# Altium schematic sheet MultimediaEthernet_USB.SchDoc
size Letter
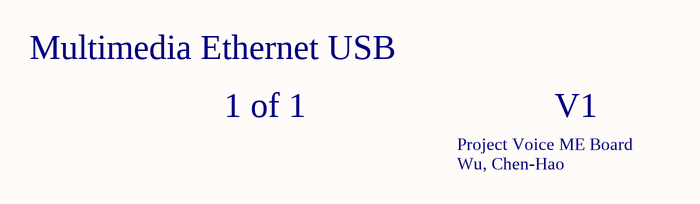
[diagram p0: MultimediaEthernet_USB.SchDoc]

## Notes on the sheet
- Multimedia Ethernet USB
- 1 of 1
- Project Voice ME Board
- V1
- Wu, Chen-Hao